# Altium schematic sheet bio_dnt_power.SchDoc: Имя
size 209 x 297 mm; ApprovedBy: Утвердил; CheckedBy: Проверил; Author: Разработал; Organization: НГУ; DocumentNumber: ЮМП.445.020.51 Э3; SheetNumber: 2; SheetTotal: Листов; PageSetup: Record=PageOptions|CenterHorizontal=True|CenterVertical=True|PrintScale=1.00|XCorrection=1.00|YCorrection=1.00|PrintKind=1|BorderSize=5000000|LeftOffset=0|BottomOffset=0|Orientation=2|PaperLength=1000|PaperWidth=1000|Scale=100|PaperSource=15|PrintQuality=1200|MediaType=1|DitherType=10|PaperKind=A3|PrintScaleMode=1; Weight: -; ScaleFactor: -; NormInspection: Норм.Контр.
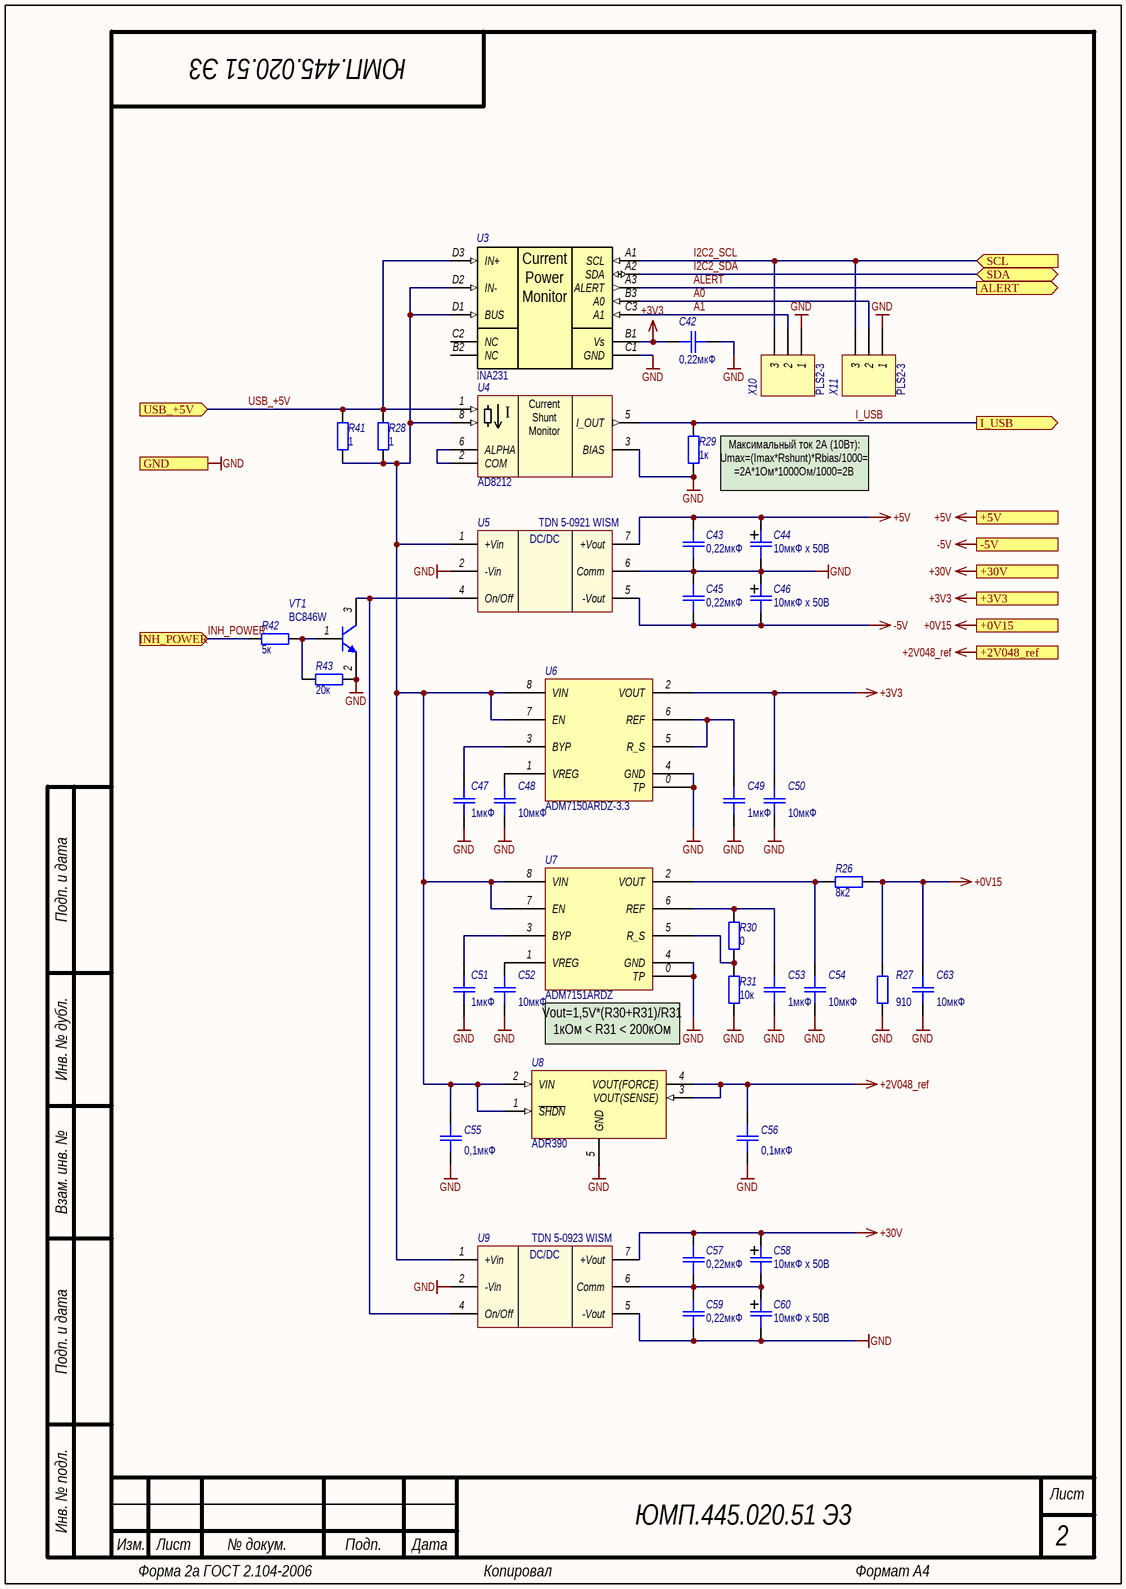
[diagram p0: bio_dnt_power.SchDoc]

## Parts
C42  0,22мкФ  [CR-0805]
C43  0,22мкФ  [CR-0805]
C44  10мкФ х 50В  [C_SMD_size_C]
C45  0,22мкФ  [CR-0805]
C46  10мкФ х 50В  [C_SMD_size_C]
C47  1мкФ  [CR-0805]
C48  10мкФ  [CR-0805]
C49  1мкФ  [CR-0805]
C50  10мкФ  [CR-0805]
C51  1мкФ  [CR-0805]
C52  10мкФ  [CR-0805]
C53  1мкФ  [CR-0805]
C54  10мкФ  [CR-0805]
C55  0,1мкФ  [CR-0805]
C56  0,1мкФ  [CR-0805]
C57  0,22мкФ  [CR-0805]
C58  10мкФ х 50В  [C_SMD_size_C]
C59  0,22мкФ  [CR-0805]
C60  10мкФ х 50В  [C_SMD_size_C]
C63  10мкФ  [CR-0805]
R26  8к2  [CR-0805]
R27  910  [CR-0805]
R28  1  [CR-0805]
R29  1к  [CR-0805]
R30  0  [CR-0805]
R31  10к  [CR-0805]
R41  1  [CR-0805]
R42  5к  [CR-0805]
R43  20к  [CR-0805]
U3  INA231  [DSBGA-12]
U4  AD8212  [MSOP-8]
U5  Наименование: TDN 5-0921 WISM  [TDN 5 WISM]  (hidden comment: TDN 5 WISM)
U6  Наименование: ADM7150ARDZ-3.3  [SOIC-8 + Exposed Pad]  (hidden comment: ADM7150)
U7  Наименование: ADM7151ARDZ  [SOIC-8 + Exposed Pad]  (hidden comment: ADM7151)
U8  Наименование: ADR390  [TSOT-5]  (hidden comment: ADR39х)
U9  Наименование: TDN 5-0923 WISM  [TDN 5 WISM]  (hidden comment: TDN 5 WISM)
VT1  Наименование: BC846W  [SOT-23]  (hidden comment: BC846BWT1)
X10  Наименование: PLS2-3  [SJMP-3]  (hidden comment: MHDR1X3)
X11  Наименование: PLS2-3  [SJMP-3]  (hidden comment: MHDR1X3)

## Ports
+0V15 (out), +2V048_ref (out), +3V3 (out), +5V (out), +30V (out), -5V (out), ALERT (out), GND (in), I_USB (out), INH_POWER (in), SCL (in), SDA (bidir), USB_+5V (in)

## Nets
+0V15: C63.2 R26.2 R27.2 ; port +0V15
+2V048_ref: C56.2 U8.3(VOUT(SENSE)) U8.4(VOUT(FORCE)) ; port +2V048_ref
+3V3: C42.2 C50.2 U3.B1(Vs) U6.2(VOUT) ; port +3V3
+5V: C43.2 C44.1 U5.7(+Vout) ; port +5V
+30V: C57.2 C58.1 U9.7(+Vout) ; port +30V
-5V: C45.1 C46.2 U5.5(-Vout) ; port -5V
GND: C42.1 C43.1 C44.2 C45.2 C46.1 C47.1 C48.1 C49.1 C50.1 C51.1 C52.1 C53.1 C54.1 C55.1 C56.1 C59.1 C60.2 C63.1 R27.1 R29.2 R31.2 R43.1 U3.C1(GND) U4.3(BIAS) U5.2(-Vin) U5.6(Comm) U6.0(TP) U6.4(GND) U7.0(TP) U7.4(GND) U8.5(GND) U9.2(-Vin) U9.5(-Vout) VT1.2(E) X10.1 X11.1 ; port GND
A0: U3.B3(A0) X11.2
A1: U3.C3(A1) X10.2
ALERT: U3.A3(ALERT) ; port ALERT
I2C2_SCL: U3.A1(SCL) X10.3 X11.3 ; port SCL
I2C2_SDA: U3.A2(SDA) ; port SDA
I_USB: R29.1 U4.5(I_OUT) ; port I_USB
INH_POWER: R42.2 ; port INH_POWER
USB_+5V: R28.1 R41.1 U3.D3(IN+) U4.1(V+) ; port USB_+5V
NetC47_2: C47.2 U6.3(BYP)
NetC48_2: C48.2 U6.1(VREG)
NetC49_2: C49.2 U6.5(R_S) U6.6(REF)
NetC51_2: C51.2 U7.3(BYP)
NetC52_2: C52.2 U7.1(VREG)
NetC53_2: C53.2 R30.1 U7.6(REF)
NetC54_2: C54.2 R26.1 U7.2(VOUT)
NetC55_2: C55.2 R28.2 R41.2 U3.D1(BUS) U3.D2(IN-) U4.8(V_SENSE) U5.1(+Vin) U6.7(EN) U6.8(VIN) U7.7(EN) U7.8(VIN) U8.1(~{SHDN}) U8.2(VIN) U9.1(+Vin)
NetC57_1: C57.1 C58.2 C59.2 C60.1 U9.6(Comm)
NetR30_2: R30.2 R31.1 U7.5(R_S)
NetR42_1: R42.1 R43.2 VT1.1(B)
NetU4_2: U4.2(COM) U4.6(ALPHA)
NetU5_4: U5.4(On/Off) U9.4(On/Off) VT1.3(C)

Not connected (* = marked no-connect by the designer): U3 B2(NC) C2(NC)

## Notes on the sheet
- Максимальный ток 2А (10Вт):
  Umax=(Imax*Rshunt)*Rbias/1000=
  =2А*1Ом*1000Ом/1000=2В
- Vout=1,5V*(R30+R31)/R31
  1кОм < R31 < 200кОм
- Подп. и дата
- Инв. № дубл.
- Взам. инв. №
- Инв. № подл.
- Изм.
- Лист
- № докум.
- Подп.
- Дата
- Форма 2а ГОСТ 2.104-2006
- Копировал
- Формат А4
- (in symbol AD8212) I; Current / Shunt / Monitor
- (in symbol INA231) Current / Power / Monitor
- (in symbol TDN 5 WISM) DC/DC

## Library data of the parts
C42 C43 C45 C47-C57 C59 C63 = C_smd: Конденсатор для поверхностного монтажа; Назначение: Чип-конденсатор; Наименование: К10-79 МП0 «ВП»; Потребление, Вт: 0
  C42 C43 C45 C57 C59: Value: 0,22мкФ
  C47 C49 C51 C53: Value: 1мкФ
  C48 C50 C52 C54 C63: Value: 10мкФ
  C55 C56: Value: 0,1мкФ
C44 C46 C58 C60 = C_pol_smd: Поляризованный конеднсатор для поверхностного монтажа; Назначение: Поляризованный чип-конденсатор; Наименование: К53-68 «ВП»; Потребление, Вт: 0; Value: 10мкФ х 50В
R26-R31 R41-R43 = R_smd: Резистор для поверхностного монтажа; Наименование: Р1-12-0.125 ОСМ; Назначение: Чип-резистор; Потребление, Вт: 0,001
  R26: Value: 8к2
  R27: Value: 910
  R28 R41: Value: 1
  R29: Value: 1к
  R30: Value: 0
  R31: Value: 10к
  R42: Value: 5к
  R43: Value: 20к
U3 = INA231: High- or Low-Side Measurement, Bidirectional Current and Power Monitor With 1.8-V I2C Interface; Назначение: Монитор параметров питания; Потребление, Вт: 0,001; Наименование: INA231
U4 = AD8212: Current Shunt Monitor; Назначение: Токовый датчик; Потребление, Вт: 0,01; Наименование: AD8212
U5 U9 = TDN 5 WISM: DC/DC converter; Назначение: DC-DC преобразователь
U6 = ADM7150: 800 mA Ultralow Noise, High PSRR, RF Linear Regulator; Назначение: Линейный регулятор; Потребление, Вт: 0,1
U7 = ADM7151: 800 mA Ultralow Noise, High PSRR, Adjustable, RF Linear Regulator; Назначение: Линейные регулятор, подстраевыемый; Потребление, Вт: 0,1
U8 = ADR39x: Micropower, Low Noise Precision Voltage Reference with Shutdown, 2.5 V Output, 2.8 to 15 V Supply, Industrial, 5-pin SOT23 (UJ-5), Reel; Manufacturer: Analog Devices; PartNumber: ADR391BUJZ-REEL7; Min V Supply (V): 2.8; Ref Out TC (ppm/C): 9; Vout: 2.5; Max V Supply (V): 15; Назначение: Источник опорного напряжения; Потребление, Вт: 0,001; ComponentLink4URL: Product URL:http://www.analog.com/en/special-linear-functions/voltage-references/adr391/products/product.html; ComponentLink2Description: Datasheet; ComponentLink1URL: http://www.analog.com/en/index.html; ComponentLink4Description: URL Link1; ComponentLink3URL: http:/www.analog.com/static/imported-files/packages/PKG_PDF/TSOT(UJ)/UJ_5.pdf; PackageVersion: 100708-A, 10/2008; ComponentLink2URL: http://www.analog.com/static/imported-files/data_sheets/ADR391_392_395.pdf; ComponentLink1Description: Manufacturer URL; DatasheetVersion: Rev. H; Code_JEDEC: MO-193-AB; Mounting Technology: Surface Mount; Packing: Reel; PackageDescription: 5-Pin Thin Small Outline Transistor Package, Body 2.9 x 1.6 mm, Pitch 0.95 mm; PackageReference: UJ-5; Operating Temp Range: -40 to 125 degC; ComponentLink3Description: Package Specification
VT1 = BC846BWT1: General Purpose Transistor, NPN Silicon, 3-Pin SC70, Tape and Reel; Manufacturer: On Semiconductor; fT Min (MHz): 100; IC Continuous (A): 0.1; Note1: 0; Назначение: Транзистор NPN; Потребление, Вт: 0,01; PackageDescription: 3-Pin Small Outline Transistor, Body 2 x 1.25 mm, Pitch 0.65 mm; PackageVersion: Rev. N, 11/2008; ComponentLink3URL: http://www.onsemi.cn/pub_link/Collateral/419-04.PDF; Polarity: NPN; ComponentLink2Description: Datasheet; Mounting Technology: Surface Mount; ComponentLink3Description: Package Specification; PartNumber: BC846BWT1; RoHS: FALSE; ComponentLink1URL: http://www.onsemi.com/; ComponentLink2URL: http://www.onsemi.cn/pub_link/Collateral/BC846AWT1-D.PDF; Packing: Tape and Reel; PackageReference: SC-70-3-419-04; DatasheetVersion: Rev. 9; ComponentLink1Description: Manufacturer URL
X10 X11 = MHDR1X3: Header, 3-Pin; Назначение: Вилка штыревая 2мм 1х3 прямая; LatestRevisionDate: 17-Jul-2002; LatestRevisionNote: Re-released for DXP Platform.; Publisher: Altium Limited